# EAGLE design automatismo (EAGLE 9.6.2)
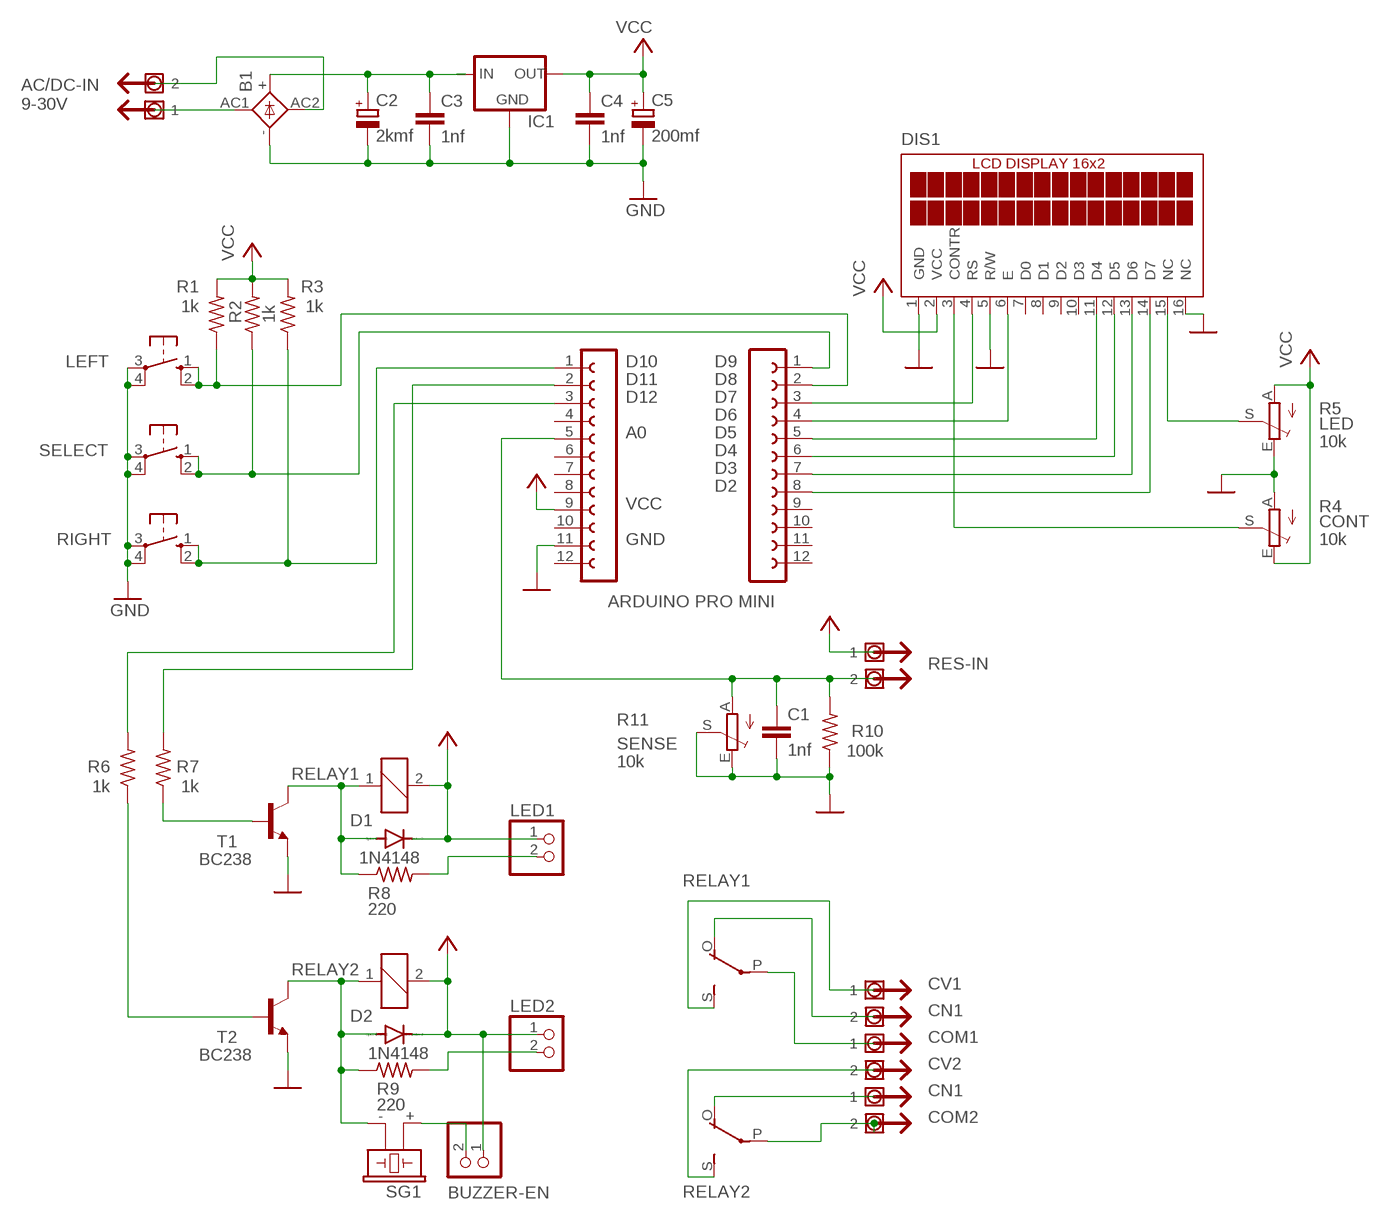
[diagram p0: schematic, sheet 1]

## Parts
B1  GBPC1  [GBPC1]
BUZZER-EN  PINHD-1X2  [1X02]
C1  1nf  C-EU050-030X075  [C050-030X075]
C2  2kmf  CPOL-EUE5-10.5  [E5-10,5]
C3  1nf  C-EU050-030X075  [C050-030X075]
C4  1nf  C-EU050-030X075  [C050-030X075]
C5  200mf  CPOL-EUE2.5-7  [E2,5-7]
D1  1N4148  1N4148DO35-7  [DO35-7]
D2  1N4148  1N4148DO35-7  [DO35-7]
DIS1  TUXGR_16X2_R2  [TUXGR_16X2_R2]
IC1  78XXL  [78XXL]
L1  FE12-1  [FE12]
L2  FE12-1  [FE12]
LED1  PINHD-1X2  [1X02]
LED2  PINHD-1X2  [1X02]
LEFT  10-XX  [B3F-10XX]
R1  1k  R-US_0207/10  [0207/10]
R2  1k  R-US_0207/10  [0207/10]
R3  1k  R-US_0207/10  [0207/10]
R4  10k  TRIM_EU-CA9V  [CA9V]
R5  10k  TRIM_EU-CA9V  [CA9V]
R6  1k  R-US_0207/10  [0207/10]
R7  1k  R-US_0207/10  [0207/10]
R8  220  R-US_0207/10  [0207/10]
R9  220  R-US_0207/10  [0207/10]
R10  100k  R-US_0207/10  [0207/10]
R11  10k  TRIM_EU-CA9V  [CA9V]
RELAY1  E3206S  [E3206S]
RELAY2  E3206S  [E3206S]
RIGHT  10-XX  [B3F-10XX]
SELECT  10-XX  [B3F-10XX]
SG1  F/CM12P  [F/CM12P]
T1  BC238  [TO92]
T2  BC238  [TO92]
U$1  WIRE-OUT  [WIRE-OUT]
U$2  WIRE-OUT  [WIRE-OUT]
U$3  WIRE-OUT  [WIRE-OUT]
U$4  WIRE-OUT  [WIRE-OUT]
U$5  WIRE-OUT  [WIRE-OUT]

## Nets
A0: C1.1 L2.5 R10.2 R11.A U$4.P$2
CONTR: DIS1.3(CONTR) R4.S
D2: DIS1.14(D7) L1.8
D3: DIS1.13(D6) L1.7
D4: DIS1.12(D5) L1.6
D5: DIS1.11(D4) L1.5
D6: DIS1.6(E) L1.4
D7: DIS1.4(RS) L1.3
D8: L1.2 LEFT.1(S) LEFT.2(S1) R1.1
D9: L1.1 R2.1 SELECT.1(S) SELECT.2(S1)
D10: L2.1 R3.1 RIGHT.1(S) RIGHT.2(S1)
D11: L2.2 R7.2
D12: L2.3 R6.2
GND: B1.- C1.2 C2.- C3.2 C4.2 C5.- DIS1.1(GND) DIS1.5(R/W) DIS1.16(NC) IC1.GND L2.11 LEFT.3(P) LEFT.4(P1) R4.A R5.E R10.1 R11.E R11.S RIGHT.3(P) RIGHT.4(P1) SELECT.3(P) SELECT.4(P1) T1.1(E) T2.1(E)
LED+: DIS1.15(NC) R5.S
N$14: R7.1 T1.2(B)
N$15: R6.1 T2.2(B)
N$16: D1.A R8.1 RELAY1.1 T1.3(C)
N$17: D2.A R9.1 RELAY2.1 SG1.- T2.3(C)
N$18: LED1.2 R8.2
N$19: LED2.2 R9.2
N$20: RELAY1.P(2:P) U$2.P$1
N$21: RELAY1.O(2:O) U$1.P$2
N$22: RELAY1.S(2:S) U$1.P$1
N$23: RELAY2.P(2:P) U$3.P$2
N$24: RELAY2.O(2:O) U$3.P$1
N$25: RELAY2.S(2:S) U$2.P$2
N$26: BUZZER-EN.2 SG1.+
N$28: B1.AC1 U$5.P$1
N$29: B1.AC2 U$5.P$2
N$30: B1.+ C2.+ C3.1 IC1.IN
VCC: BUZZER-EN.1 C4.1 C5.+ D1.C D2.C DIS1.2(VCC) IC1.OUT L2.9 LED1.1 LED2.1 R1.2 R2.2 R3.2 R4.E R5.A RELAY1.2 RELAY2.2 U$4.P$1
Unconnected: DIS1.7(D0) DIS1.8(D1) DIS1.9(D2) DIS1.10(D3) L1.9 L1.10 L1.11 L1.12 L2.4 L2.6 L2.7 L2.8 L2.10 L2.12

## Notes on the sheet
- AC/DC-IN 
  9-30V
- LED
- CONT
- ARDUINO PRO MINI
- RES-IN
- SENSE
- CV1
- CN1
- COM1
- CV2
- CN1
- COM2

## Library data of the parts
B1 = rectifier:GBPC1: GENERAL INSTRUMENT RECTIFIER
BUZZER-EN LED1 LED2 = pinhead:PINHD-1X2: PIN HEADER
C1 C3 C4 = rcl:C-EU: CAPACITOR, European symbol; SPICEPREFIX: C
C2 C5 = rcl:CPOL-EU: POLARIZED CAPACITOR, European symbol; SPICEPREFIX: C
D1 D2 = diode:1N4148: DIODE high speed (Philips)
DIS1 = display-lcd:TUXGR_16X2_R2: Tuxgraphics LCD display 16x2 characters reflective, without background light Source: tuxgr_12x2_r2.pdf; OC_FARNELL: unknown; OC_NEWARK: unknown
IC1 = v-reg:78XXL: VOLTAGE REGULATOR
L1 L2 = con-lsta:FE12-1: FEMALE HEADER; OC_FARNELL: unknown; OC_NEWARK: unknown
LEFT RIGHT SELECT = switch-omron:10-XX: OMRON SWITCH; MPN: B3F-1000; OC_FARNELL: 176432; OC_NEWARK: 36M3542
R1-R3 R6-R10 = rcl:R-US_: RESISTOR, American symbol; SPICEPREFIX: R
R4 R5 R11 = pot:TRIM_EU-: POTENTIOMETER
RELAY1 RELAY2 = relay:E3206S: RELAY 1 x switch, Eichhoff/distributor Schukat; OC_FARNELL: unknown; OC_NEWARK: unknown; SPICEPREFIX: J
SG1 = buzzer:F/CM12P: BUZZER Source: Buerklin; OC_FARNELL: unknown; OC_NEWARK: unknown
T1 T2 = transistor:BC238: NPN TRANSISTOR
U$1-U$5 = mylib:WIRE-OUT

## Board
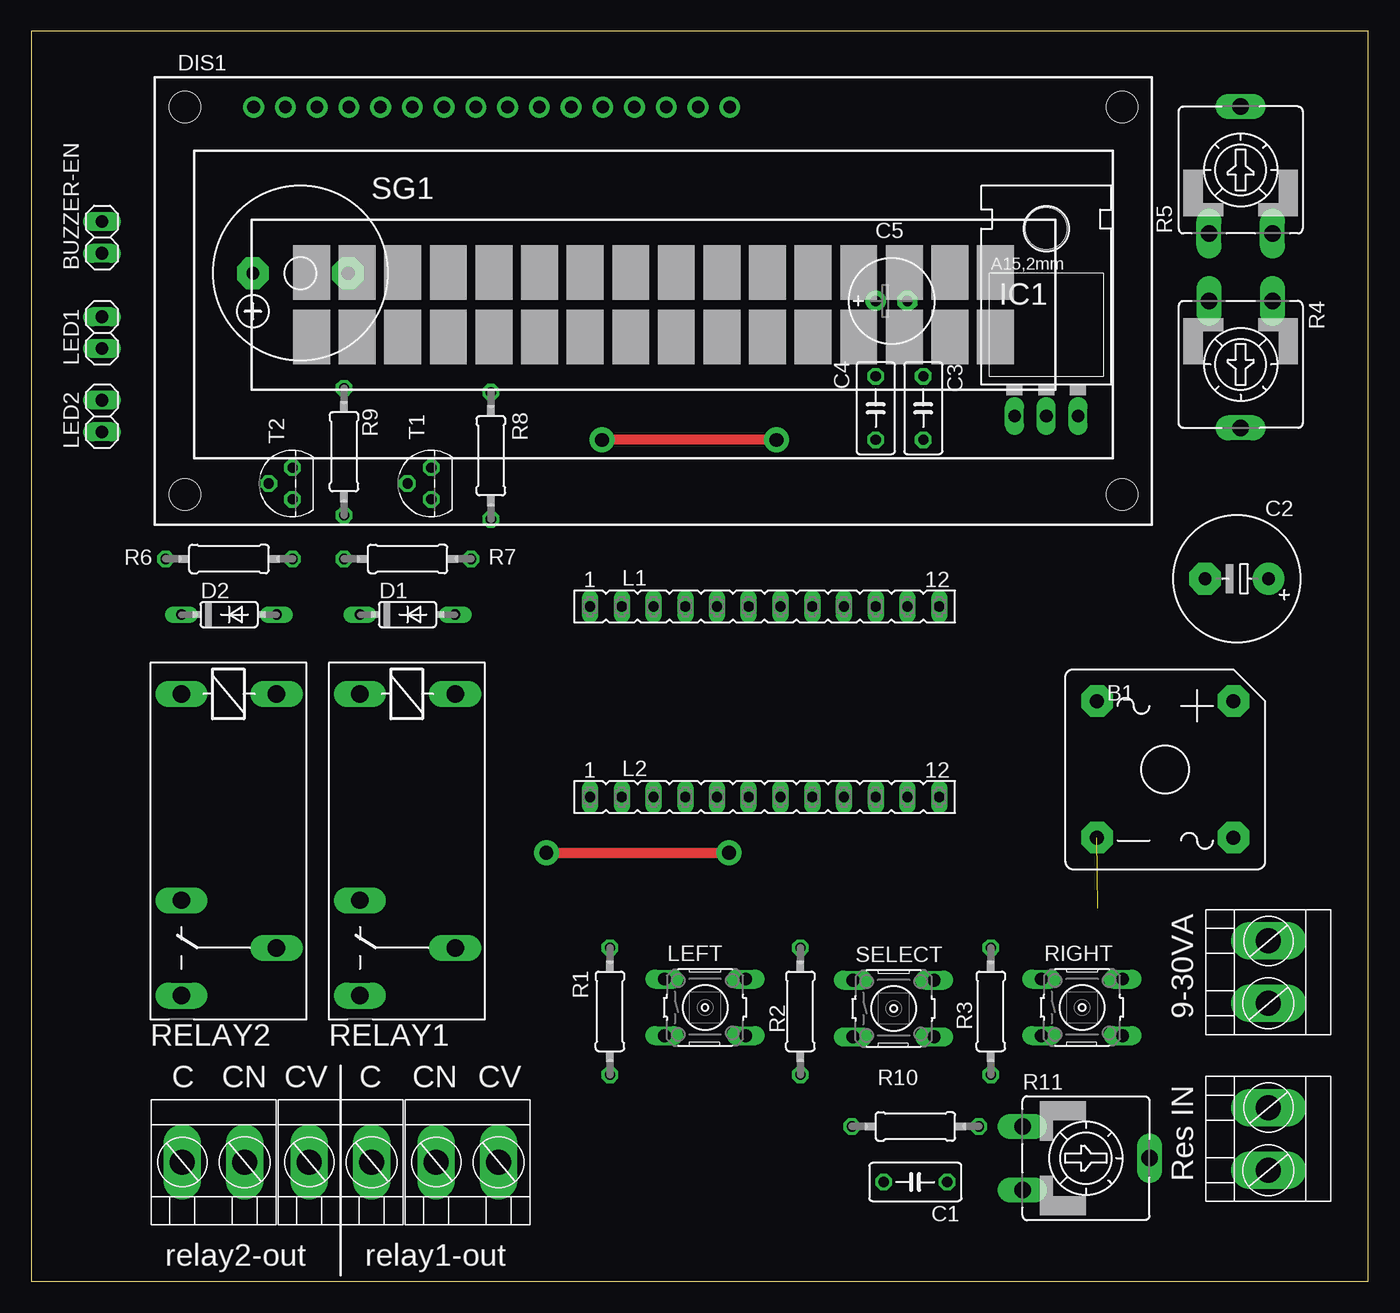
[diagram p1: board, top side]
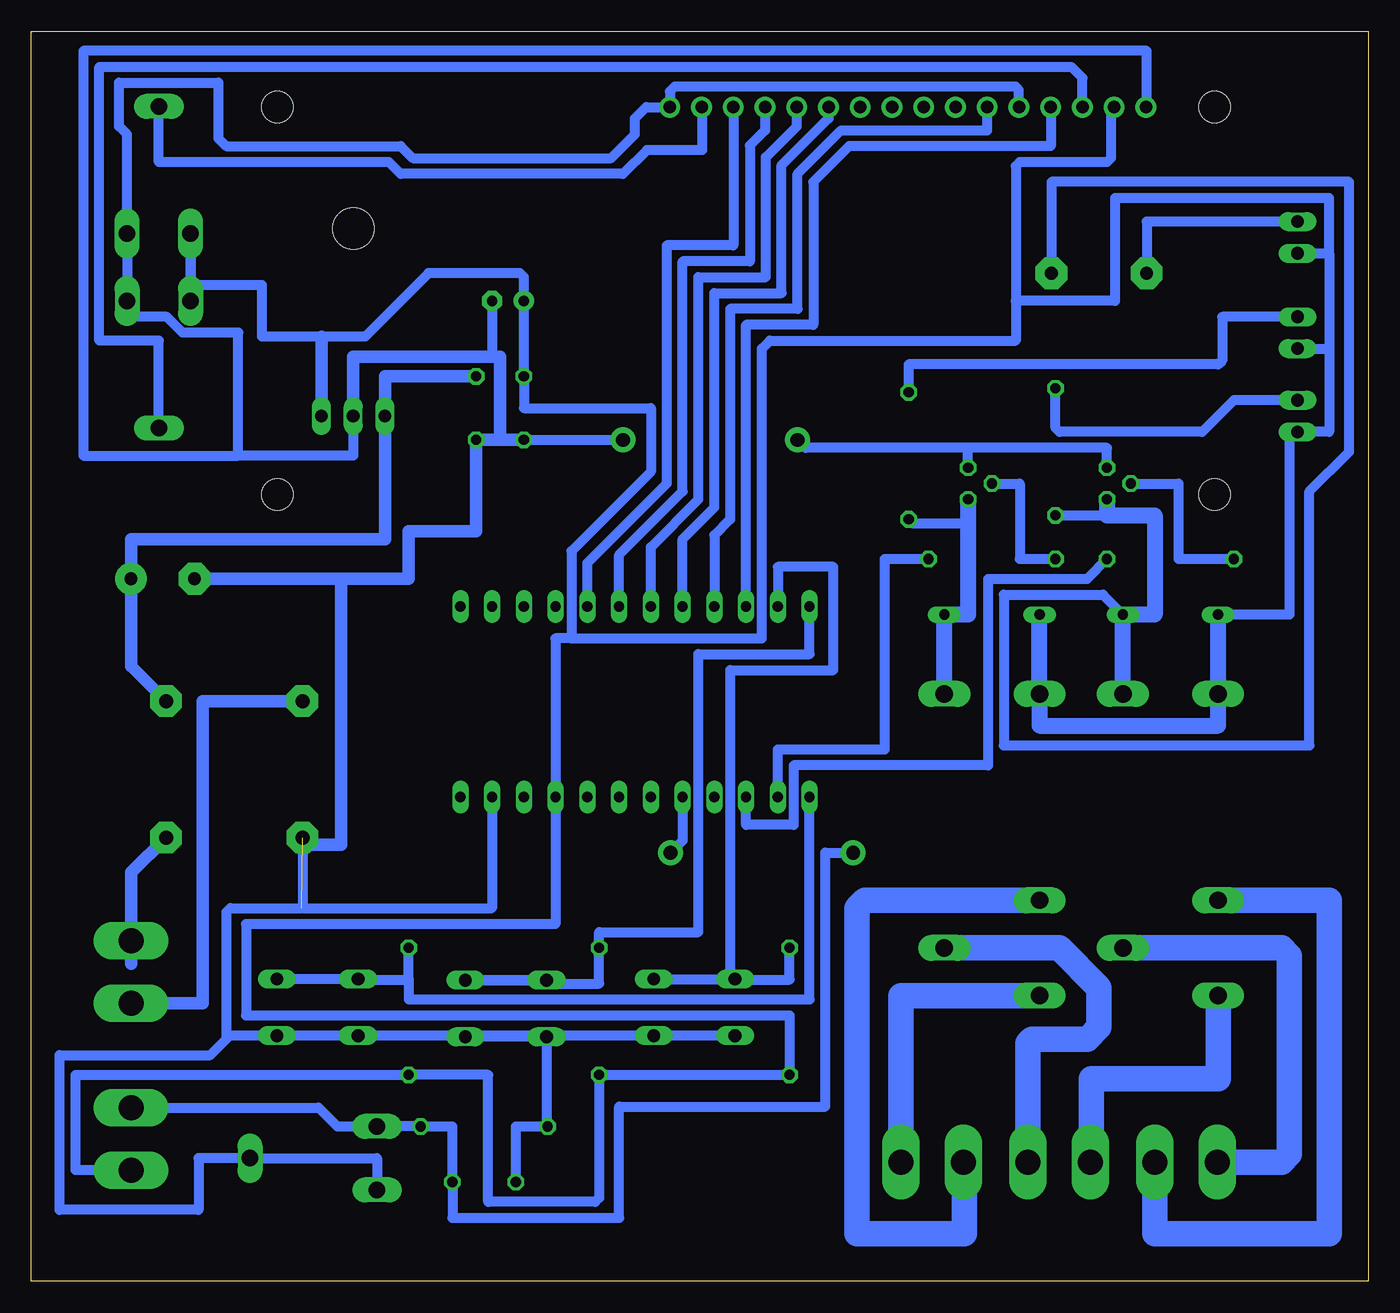
[diagram p2: board, bottom side, seen from below]

Size 107 x 100 mm. Coordinates in mm from the lower left corner, seen from the top.
Outline: 0,0 107,0 107,100 0,100 0,0
Copper layers (1*16): Top 0.035mm / dielectric 1.5mm / Bottom 0.035mm
Design rules "default": minimum track width 6mil, minimum drill 0.35mm, track to track 6mil, track to pad 6mil, pad to pad 6mil, via to via 6mil, smd to smd 6mil, copper to edge 40mil, drill to drill 6mil, minimum pad ring 10mil, minimum via ring 8mil, stop-mask expansion 4mil, vias tented up to drill 0mil, thermal gap 10mil

### Footprints (pad centres in the part's own frame; a part is rotated, then mirrored left to right if it is on the bottom)
GBPC1 = drill 1.118 pad 2.54 octagon: + 5.461,5.461; - -5.461,-5.461; AC1 -5.461,5.461; AC2 5.461,-5.461
1X02 = drill 1.016 long: 1 -1.27,0; 2 1.27,0
C050-030X075 = drill 0.813 octagon: 1 -2.54,0; 2 2.54,0
E5-10,5 = drill 1.016 pad 2.54: + -2.54,0 | drill 1.016 pad 2.54 octagon: - 2.54,0
E2,5-7 = drill 0.813 pad 1.6: + -1.27,0 | drill 0.813 pad 1.6 octagon: - 1.27,0
DO35-7 = drill 0.813 long: A 3.81,0; C -3.81,0
TUXGR_16X2_R2 = drill 1 pad 1.676: 1 -32,15.5; 2 -29.46,15.5; 3 -26.92,15.5; 4 -24.38,15.5; 5 -21.84,15.5; 6 -19.3,15.5; 7 -16.76,15.5; 8 -14.22,15.5; 9 -11.68,15.5; 10 -9.14,15.5; 11 -6.6,15.5; 12 -4.06,15.5; 13 -1.52,15.5; 14 1.02,15.5; 15 3.56,15.5; 16 6.1,15.5 | hole 2.5: -37.5,-15.5; 37.5,-15.5; -37.5,15.5; 37.5,15.5
78XXL = drill 1.016 long: GND 0,-3.81; IN -2.54,-3.81; OUT 2.54,-3.81 | hole 3.302: 0,11.176
FE12 = drill 0.813 long: 1 -13.97,0; 2 -11.43,0; 3 -8.89,0; 4 -6.35,0; 5 -3.81,0; 6 -1.27,0; 7 1.27,0; 8 3.81,0; 9 6.35,0; 10 8.89,0; 11 11.43,0; 12 13.97,0
B3F-10XX = drill 1.016 long: 1 -3.251,2.261; 2 3.251,2.261; 3 -3.251,-2.261; 4 3.251,-2.261
0207/10 = drill 0.813 octagon: 1 -5.08,0; 2 5.08,0
CA9V = drill 1.321 long: A -2.54,-5.08; E 2.54,-5.08; S 0,5.08
E3206S = drill 1.397 long: 1 -3.175,3.81; 2 -3.175,-3.81; O 13.335,-3.81; P 17.145,3.81; S 20.955,-3.81
F/CM12P = drill 1.016 pad 2.54 octagon: + 3.81,0; - -3.81,0
TO92 = drill 0.813 octagon: 1 1.27,0; 2 0,1.905; 3 -1.27,0
WIRE-OUT = drill 2 long: P$1 0,0; P$2 5,0

### Placement (x,y rotation side)
B1  90.76,40.96 0 top
BUZZER-EN  5.67,83.5 90 top
C1  70.75,7.94 180 top
C2  96.47,56.2 180 top
C3  71.39,69.85 270 top
C4  67.58,69.85 270 top
C5  68.85,78.42 0 top
D1  30.11,53.34 0 top
D2  15.83,53.34 0 top
DIS1  49.8,78.42 0 top
IC1  81.23,73.03 0 top
L1  58.69,53.98 0 top
L2  58.69,38.73 0 top
LED1  5.67,75.88 90 top
LED2  5.67,69.22 90 top
LEFT  53.93,21.91 0 top
R1  46.31,21.59 270 top
R2  61.55,21.59 270 top
R3  76.79,21.59 270 top
R4  96.79,73.34 180 top
R5  96.79,88.9 0 top
R6  15.83,57.78 0 top
R7  30.11,57.78 0 top
R8  36.78,66.04 90 top
R9  25.04,66.36 90 top
R10  70.75,12.38 0 top
R11  84.41,9.84 270 top
RELAY1  30.11,43.81 270 top
RELAY2  15.83,43.81 270 top
RIGHT  84.09,21.91 0 top
SELECT  69.01,21.82 0 top
SG1  21.54,80.64 180 top
T1  32.02,63.82 90 top
T2  20.91,63.82 90 top
U$1  37.42,9.53 180 top
U$2  27.26,9.53 180 top
U$3  17.1,9.53 180 top
U$4  99.01,8.89 90 top
U$5  99.01,22.23 90 top

### Tracks (layer width: path | path; a pad name or v marks a point on that pad's centre or on a via)
A0  (via drill 1.1 pad 2)
  Top 0.813: v41.23,34.29 v55.83,34.29 56.15,34.29
  Bottom 0.813: U$4.P$2 84.01,13.89 82.5,12.38 R11.A R10.2 73.3,12.38 C1.1 73.3,5.08 59.96,5.08 59.96,13.97 43.45,13.97 43.45,34.29 v41.23,34.29 | v55.83,34.29 54.88,35.24 L2.5
CONTR
  Bottom 0.813: R4.S 96.79,75.25 101.55,75.25 101.55,97.16 23.77,97.16 22.88,96.27 DIS1.3
D2
  Bottom 0.813: DIS1.14 50.82,82.87 56.15,82.87 56.15,63.82 62.5,57.47 L1.8
D3
  Bottom 0.813: DIS1.13 48.28,92.08 49.48,90.87 49.48,81.6 54.88,81.6 54.88,63.18 59.96,58.1 L1.7
D4
  Bottom 0.813: DIS1.12 45.74,92.39 48.21,89.92 48.21,80.33 53.61,80.33 53.61,62.55 57.42,58.74 L1.6
D5
  Bottom 0.813: DIS1.11 43.2,93.03 46.94,89.28 46.94,79.06 52.34,79.06 52.34,61.91 54.88,59.37 L1.5
D6
  Bottom 0.813: DIS1.6 30.5,92.08 42.18,92.08 45.67,88.58 45.67,77.79 51.07,77.79 51.07,60.96 52.34,59.69 L1.4
D7
  Bottom 0.813: L1.3 49.8,76.52 44.4,76.52 44.4,87.95 41.55,90.81 25.42,90.81 DIS1.4
D8
  Bottom 0.813: R1.1 46.31,24.13 50.64,24.13 LEFT.1 LEFT.2 51.07,24.17 51.07,48.9 42.81,48.9 42.81,57.15 47.26,57.15 L1.2
D9
  Bottom 0.813: L1.1 44.72,50.16 53.61,50.16 53.61,27.94 61.55,27.94 R2.1 61.55,23.81 65.49,23.81 SELECT.1 SELECT.2 66.87,24.08
D10
  Bottom 0.813: RIGHT.2 RIGHT.1 80.8,24.13 76.79,24.13 | 76.79,24.13 R3.1 | 76.79,24.13 76.79,22.54 44.72,22.54 L2.1
D11
  Bottom 0.813: L2.2 47.26,42.55 38.69,42.55 38.69,57.78 R7.2
D12
  Bottom 0.813: R6.2 22.5,56.2 30.43,56.2 30.43,41.27 45.99,41.27 45.99,36.51 49.8,36.51 L2.3
GND  (via drill 1.1 pad 2)  (1 unrouted)
  Top 0.813: v59.64,67.31 v45.67,67.31
  Bottom 0.813: DIS1.5 27.96,95.32 28.21,95.57 55.52,95.57 55.9,95.18 DIS1.16 57.8,93.92 58.69,93.03 58.69,91.76 60.59,89.85 76.47,89.85 77.42,90.81 91.39,90.81 92.03,91.44 92.03,95.89 99.97,95.89 99.97,92.39 99.33,91.76 R5.E R4.A 99.33,77.15 96.16,77.15 94.89,75.88 90.44,75.88 90.44,66.04 | LEFT.3 LEFT.4 72.35,19.65 | 85.36,29.84 91.08,29.84 91.39,29.53 91.39,19.65 91.35,19.65 | L2.11 70.12,29.84 85.3,29.84 B1.- | RIGHT.3 RIGHT.4 | RIGHT.4 91.35,19.65 | 72.35,19.65 SELECT.4 SELECT.3 65.76,12.61 65.99,12.38 | 72.35,19.65 RIGHT.4 | T2.1 20.91,66.67 32.02,66.67 | T1.1 32.02,66.67 | IC1.GND 81.23,66.04 90.44,66.04 | C5.- 70.12,73.98 | R11.E 79.33,9.84 R11.S 93.61,9.84 93.61,5.71 104.73,5.71 104.73,18.1 92.66,18.1 91.35,19.41 91.35,19.65 | C1.2 68.22,12.38 65.99,12.38 | 65.99,12.38 R10.1 | DIS1.1 17.73,93.99 17.73,98.42 102.82,98.42 102.82,66.04 90.44,66.04 | C4.2 v59.64,67.31 59.33,67.31 | v45.67,67.31 45.04,66.67 32.02,66.67
  Bottom 1.016: C2.- 82.19,56.2 | 82.19,56.2 76.79,56.2 76.79,60.01 71.39,60.01 C3.2 69.48,67.31 | 82.19,56.2 82.19,34.92 84.72,34.92 B1.- | C4.2 69.48,67.31 | 69.48,67.31 69.48,73.98 70.12,73.98 81.23,73.98 IC1.GND
LED+
  Bottom 0.813: DIS1.15 53.29,93.86 53.29,90.49 57.74,90.49 59.64,88.58 77.42,88.58 78.38,89.53 96.79,89.53 R5.S
N$14
  Bottom 0.813: T1.2 27.89,63.82 27.89,57.78 R7.1
N$15
  Bottom 0.813: T2.2 15.19,63.82 15.19,57.78 R6.1
N$16
  Bottom 0.813: R8.1 36.47,60.64 32.02,60.64
  Bottom 1.27: RELAY1.1 D1.A 32.02,53.34 32.02,60.64 T1.3
N$17
  Bottom 0.813: R9.1 20.91,61.28 | D2.A 21.23,54.93 29.16,54.93 29.16,42.86 4.71,42.86 4.71,63.18 1.54,66.36 1.54,87.95 25.35,87.95 SG1.-
  Bottom 1.27: RELAY2.1 D2.A 17.1,53.34 17.1,61.28 20.91,61.28 T2.3
N$18
  Bottom 0.813: LED1.2 11.7,77.15 11.7,73.66 12.02,73.34 36.78,73.34 R8.2
N$19
  Bottom 0.813: R9.2 25.04,68.26 24.72,67.94 13.29,67.94 10.75,70.48 LED2.2
N$20
  Bottom 2.032: RELAY1.P 24.72,26.67 21.54,23.5 21.54,20.32 22.5,19.37 26.94,19.37 27.26,19.05 U$2.P$1
N$21
  Bottom 2.032: RELAY1.O 40.27,30.48 40.91,29.84 40.91,3.81 32.34,3.81 32.34,9.45 U$1.P$2
N$22
  Bottom 2.032: RELAY1.S 37.42,22.86 U$1.P$1
N$23
  Bottom 2.032: RELAY2.P 6.94,26.67 6.3,26.04 6.3,10.16 6.94,9.53 U$3.P$2
N$24
  Bottom 2.032: U$3.P$1 17.1,3.81 3.13,3.81 3.13,30.48 RELAY2.O
N$25
  Bottom 2.032: U$2.P$2 22.18,9.61 22.18,16.19 12.02,16.19 RELAY2.S
N$26
  Bottom 0.813: BUZZER-EN.2 17.73,84.77 SG1.+
N$28
  Bottom 1.016: U$5.P$1 93.3,22.23 93.3,46.42 B1.AC1
N$29
  Bottom 1.016: B1.AC2 99.01,32.7 99.01,25.4 | 99.01,26.67 U$5.P$2
N$30
  Bottom 1.016: B1.+ 99.01,49.21 C2.+ 99.01,59.37 78.69,59.37 IC1.IN 78.69,72.39 C3.1
VCC
  Bottom 0.813: R4.E R5.A 94.25,79.38 | 94.25,79.38 94.25,78.74 | 63.77,51.44 63.77,58.42 57.42,64.77 57.42,69.85 67.58,69.85 C4.1 C5.+ 67.58,80.33 67.9,80.64 75.2,80.64 80.28,75.56 83.77,75.56 88.53,75.56 88.53,79.69 93.93,79.69 94.25,79.38 | LED1.1 3.13,74.61 | 3.13,74.61 3.13,67.94 LED2.1 6.3,67.94 6.3,53.34 D2.C | BUZZER-EN.1 3.13,82.23 | 3.13,82.23 3.13,74.61 | U$4.P$1 103.46,8.89 103.46,16.51 R3.2 70.44,16.51 70.44,6.35 61.87,6.35 61.55,6.67 R2.2 R1.2 46.31,21.27 89.81,21.27 89.81,28.57 65.04,28.57 L2.9 65.04,51.44 63.77,51.44 | 3.13,82.23 3.13,86.68 20.27,86.68 20.27,78.42 28.21,78.42 | DIS1.2 20.59,93.67 20.59,89.85 20.91,89.53 27.89,89.53 28.21,89.22 28.21,78.42 | 28.21,78.42 28.21,75.25 47.9,75.25 48.53,74.61 48.53,51.44 63.77,51.44
  Bottom 1.016: 83.77,75.56 IC1.OUT
  Bottom 1.27: D2.C RELAY2.2 12.02,44.45 26.3,44.45 RELAY1.2 D1.C

### Text on the board
tPlace: 9-30VA | C | CN | CV | C | CN | CV | Res IN | relay2-out | relay1-out